# EAGLE design mainboard (EAGLE 7.6.0)
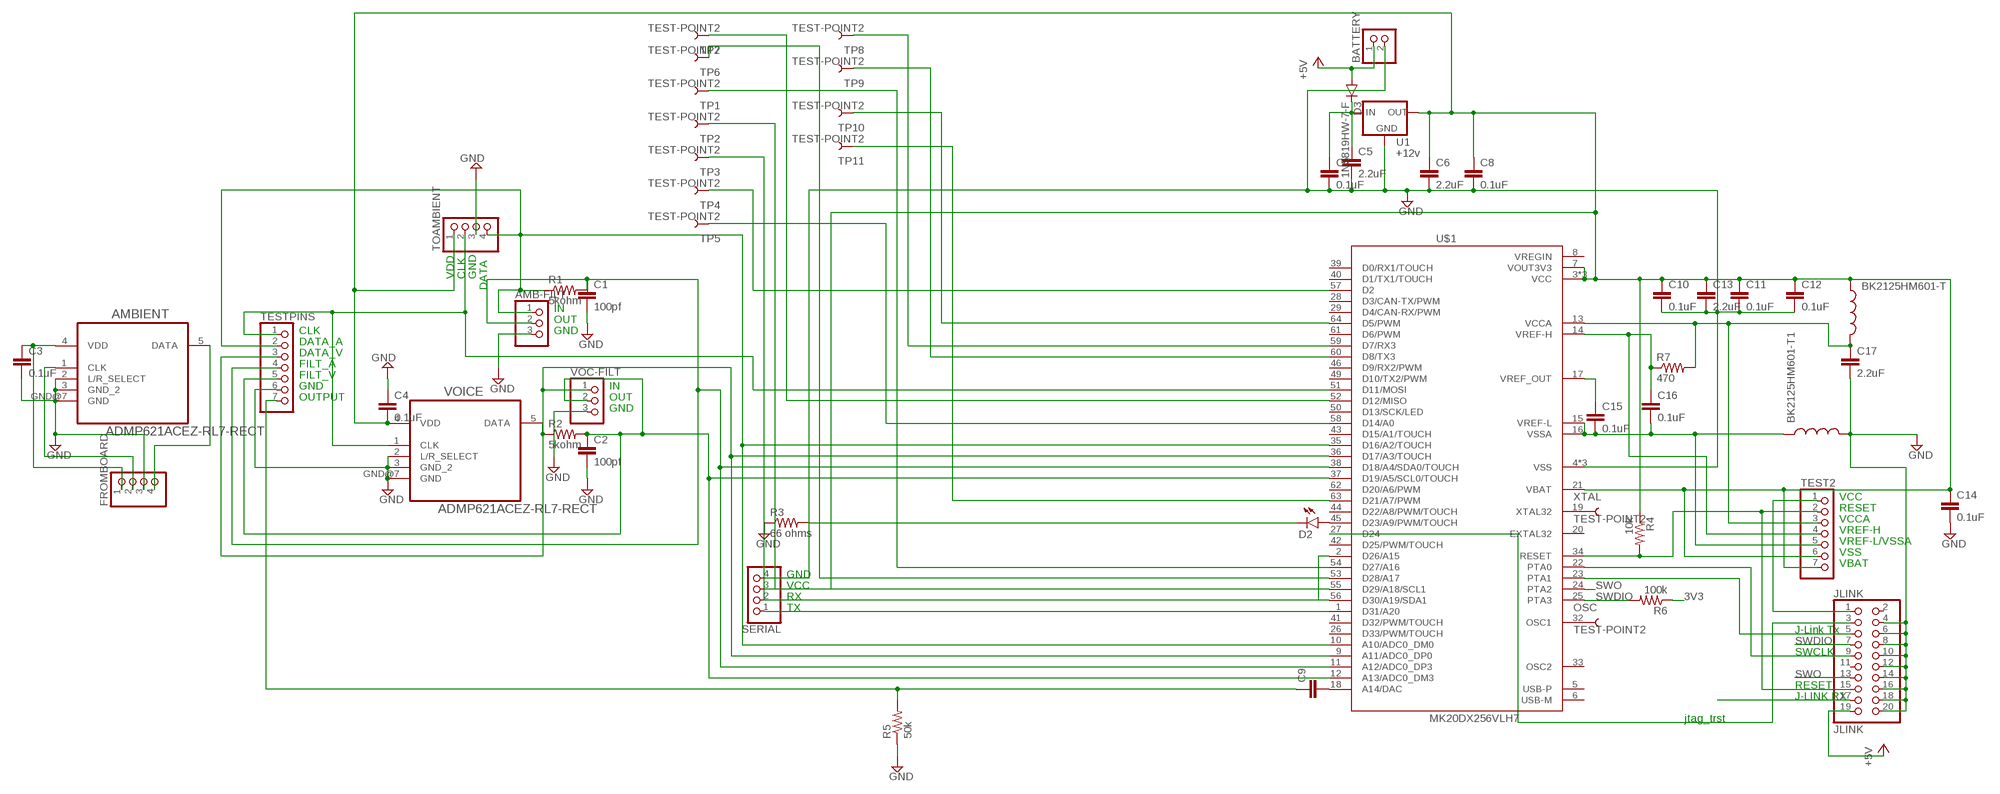
[diagram p0: schematic, sheet 1]

## Parts
AMB-FILT  PINHD-1X3  [1X03]
AMBIENT  ADMP621ACEZ-RL7-RECT  [ADMP621ACEZ-RL7-RECT]
BATTERY  PINHD-1X2  [1X02]
BK2125HM601-T  INDUCTOR0805  [0805]
BK2125HM601-T1  INDUCTOR0805  [0805]
C1  100pf  CAP0805  [0805]
C2  100pf  CAP0805  [0805]
C3  0.1uF  CAP0805  [0805]
C4  0.1uF  CAP0805  [0805]
C5  2.2uF  CAP0805  [0805]
C6  2.2uF  CAP0805  [0805]
C7  0.1uF  CAP0805  [0805]
C8  0.1uF  CAP0805  [0805]
C9  CAP0805  [0805]
C10  0.1uF  CAP0805  [0805]
C11  0.1uF  CAP0805  [0805]
C12  0.1uF  CAP0805  [0805]
C13  2.2uF  CAP0805  [0805]
C14  0.1uF  CAP0805  [0805]
C15  0.1uF  CAP0805  [0805]
C16  0.1uF  CAP0805  [0805]
C17  2.2uF  CAP0805  [0805]
D2  LED1206  [LED-1206]
D3  1N5819HW-7-F  DIODESOD123  [SOD-123]
FROMBOARD  PINHD-1X4  [1X04]
JLINK  JLINK  PINHD-2X10  [2X10]
OSC  TEST-POINT2  [PAD.02X.02]
R1  5kohm  RESISTOR0805-RES  [0805]
R2  5kohm  RESISTOR0805-RES  [0805]
R3  66 ohms  RESISTOR0805-RES  [0805]
R4  10k  RESISTOR0805-RES  [0805]
R5  50k  RESISTOR0805-RES  [0805]
R6  100k  RESISTOR0805-RES  [0805]
R7  470  RESISTOR0805-RES  [0805]
SERIAL  PINHD-1X4  [1X04]
TEST2  PINHD-1X7  [1X07]
TESTPINS  PINHD-1X7  [1X07]
TOAMBIENT  PINHD-1X4M  [1X04M]
TP1  TEST-POINT2  [PAD.02X.02]
TP2  TEST-POINT2  [PAD.02X.02]
TP3  TEST-POINT2  [PAD.02X.02]
TP4  TEST-POINT2  [PAD.02X.02]
TP5  TEST-POINT2  [PAD.02X.02]
TP6  TEST-POINT2  [PAD.02X.02]
TP7  TEST-POINT2  [PAD.02X.02]
TP8  TEST-POINT2  [PAD.02X.02]
TP9  TEST-POINT2  [PAD.02X.02]
TP10  TEST-POINT2  [PAD.02X.02]
TP11  TEST-POINT2  [PAD.02X.02]
U1  +12v  V_REG_78XX7812  [TO-252]
U$1  MK20DX256VLH7  [QFP50P1200X1200X160-64N]
VOC-FILT  PINHD-1X3  [1X03]
VOICE  ADMP621ACEZ-RL7-RECT  [ADMP621ACEZ-RL7-RECT]
XTAL  TEST-POINT2  [PAD.02X.02]

## Nets
3V3: R6.1
+5V: BATTERY.1 D3.A JLINK.19
CLK: TESTPINS.1 TOAMBIENT.2 U$1.51(D11/MOSI) VOICE.1(CLK)
CLK2-A: AMBIENT.1(CLK) FROMBOARD.2
DATA: R2.1 TESTPINS.3 U$1.9(A11/ADC0_DP0) U$1.36(D17/A3/TOUCH) VOC-FILT.1 VOICE.5(DATA)
DATA2: AMB-FILT.1 R1.1 TESTPINS.2 TOAMBIENT.4 U$1.10(A10/ADC0_DM0) U$1.35(D16/A2/TOUCH)
DATA2-A: AMBIENT.5(DATA) FROMBOARD.4
GND: AMB-FILT.3 AMBIENT.2(L/R_SELECT) AMBIENT.3(GND_2) AMBIENT.GND@7(GND) BATTERY.2 BK2125HM601-T1.2 C1.2 C2.2 C3.2 C4.1 C5.2 C6.2 C7.2 C8.2 C10.2 C11.2 C12.2 C13.2 C14.2 C17.2 FROMBOARD.3 JLINK.4 JLINK.6 JLINK.8 JLINK.10 JLINK.12 JLINK.14 JLINK.16 JLINK.18 JLINK.20 R3.1 R5.1 SERIAL.4 TESTPINS.6 TOAMBIENT.3 U1.3(GND) U$1.4(VSS) U$1.31(VSS) U$1.47(VSS) VOC-FILT.3 VOICE.2(L/R_SELECT) VOICE.3(GND_2) VOICE.GND@7(GND)
JTAG_TRST: JLINK.3 U$1.27(D24)
N$1: AMB-FILT.2 C1.1 R1.2 TESTPINS.4 U$1.11(A12/ADC0_DP3) U$1.38(D18/A4/SDA0/TOUCH)
N$2: C2.1 R2.2 TESTPINS.5 U$1.12(A13/ADC0_DM3) U$1.37(D19/A5/SCL0/TOUCH) VOC-FILT.2
N$3: TP7.P$1 U$1.52(D12/MISO)
N$4: TP6.P$1 U$1.53(D28/A17)
N$5: TP1.P$1 U$1.54(D27/A16)
N$6: TP2.P$1 U$1.55(D29/A18/SCL1)
N$7: TP3.P$1 U$1.56(D30/A19/SDA1)
N$8: TP4.P$1 U$1.57(D2)
N$9: TP5.P$1 U$1.58(D14/A0)
N$10: TP8.P$1 U$1.59(D7/RX3)
N$12: TP9.P$1 U$1.60(D8/TX3)
N$13: JLINK.5 U$1.23(PTA1)
N$14: JLINK.9 U$1.22(PTA0)
N$15: C5.1 C7.1 D3.C U1.2(IN)
N$16: JLINK.1 TEST2.1
N$17: D2.A U$1.45(D23/A9/PWM/TOUCH)
N$18: TP10.P$1 U$1.64(D5/PWM)
N$19: D2.C R3.2
N$20: BK2125HM601-T1.1 C15.2 C16.2 TEST2.5 U$1.15(VREF-L) U$1.16(VSSA)
N$21: TP11.P$1 U$1.63(D21/A7/PWM)
N$22: C16.1 R7.1 TEST2.4 U$1.14(VREF-H)
N$23: U$1.19(XTAL32) XTAL.P$1
N$24: JLINK.17
N$25: SERIAL.1 U$1.1(D31/A20)
N$26: SERIAL.2 U$1.2(D26/A15)
N$27: C9.2 U$1.18(A14/DAC)
N$28: C9.1 R5.2 TESTPINS.7
N$29: OSC.P$1 U$1.32(OSC1)
N$30: BK2125HM601-T.2 C17.1 R7.2 TEST2.3 U$1.13(VCCA)
N$31: C15.1 U$1.17(VREF_OUT)
RESET: JLINK.15 R4.2 TEST2.2 U$1.34(RESET)
SWDIO: JLINK.7 R6.2 U$1.25(PTA3)
SWO: JLINK.13 U$1.24(PTA2)
VDD-DECOUP: BK2125HM601-T.1 C4.2 C6.1 C8.1 C10.1 C11.1 C12.1 C13.1 C14.1 R4.1 SERIAL.3 TEST2.6 TEST2.7 TOAMBIENT.1 U1.1(OUT) U$1.3(VCC) U$1.7(VOUT3V3) U$1.21(VBAT) U$1.30(VCC) U$1.48(VCC) VOICE.4(VDD)
VDD-DECOUP-A: AMBIENT.4(VDD) C3.1 FROMBOARD.1
Unconnected: JLINK.2 JLINK.11 U$1.5(USB-P) U$1.6(USB-M) U$1.8(VREGIN) U$1.20(EXTAL32) U$1.26(D33/PWM/TOUCH) U$1.28(D3/CAN-TX/PWM) U$1.29(D4/CAN-RX/PWM) U$1.33(OSC2) U$1.39(D0/RX1/TOUCH) U$1.40(D1/TX1/TOUCH) U$1.41(D32/PWM/TOUCH) U$1.42(D25/PWM/TOUCH) U$1.43(D15/A1/TOUCH) U$1.44(D22/A8/PWM/TOUCH) U$1.46(D9/RX2/PWM) U$1.49(D10/TX2/PWM) U$1.50(D13/SCK/LED) U$1.61(D6/PWM) U$1.62(D20/A6/PWM)

## Notes on the sheet
- VDD | CLK | GND
- DATA
- IN
- OUT
- CLK | GND
- DATA_A
- DATA_V
- FILT_A
- FILT_V
- GND | IN
- OUTPUT | OUT
- GND
- VCC
- RESET
- VCCA
- VREF-H
- VREF-L/VSSA
- VSS
- VBAT
- GND
- VCC
- RX
- TX
- J-Link Tx
- SWCLK
- RESET
- J-LINK RX
- jtag_trst

## Library data of the parts
AMB-FILT VOC-FILT = pinhead:PINHD-1X3: PIN HEADER
AMBIENT VOICE = InvenSense-INMP621ACEZ-R7-rect:ADMP621ACEZ-RL7-RECT: IC, MICROPHONE, 2 CH , LGA_CAV-5; MPN: ADMP621ACEZ-RL7; OC_FARNELL: 2361525; OC_NEWARK: 08X1061; PACKAGE: 5LGA; SUPPLIER: ANALOG DEVICES
BATTERY = pinhead:PINHD-1X2: PIN HEADER
BK2125HM601-T BK2125HM601-T1 = SparkFun-Passives:INDUCTOR: Inductors Basic Inductor/Choke - 0603 and 1206. Footprints are not proven and vary greatly between part numbers. INDUCTOR POWER 3.3UH 4.0A SMD 0.197" L x 0.197" W x 0.177" H (5.00mm x 5.00mm x 4.50mm)
C1-C17 = SparkFun-Capacitors:CAP: Capacitor Standard 0603 ceramic capacitor, and 0.1" leaded capacitor.
D2 = SparkFun-LED:LED: LEDs Standard schematic elements and footprints for 5mm, 3mm, 1206, and 0603 sized LEDs. 5mm - Spark Fun Electronics SKU : COM-00529 (and others)
D3 = SparkFun-DiscreteSemi:DIODE: Diode These are standard reverse protection diodes and small signal diodes. SMA package can handle up to about 1A. SOD-323 can handle about 200mA. What the SOD-323 package when ordering, there are some mfgs out there that are 5-pin packages.
FROMBOARD SERIAL TOAMBIENT = pinhead:PINHD-1X4: PIN HEADER
JLINK = pinhead:PINHD-2X10: PIN HEADER
OSC TP1-TP11 XTAL = SparkFun-Passives:TEST-POINT: Bare copper test points for troubleshooting or ICT
R1-R7 = SparkFun-Passives:RESISTOR: Resistor Basic schematic elements and footprints for 0603, 1206, and PTH resistors.
TEST2 TESTPINS = pinhead:PINHD-1X7: PIN HEADER
U1 = LP38691:V_REG_78XX: Voltage Regulator Standard 78xx regulator. IGO (Input Ground Output). Spark Fun Electronics SKU : COM-00107; PROD_ID: VREG-12370
U$1 = Teensy_DIY_v1.0:MK20DX256VLH7: This is a footprint for the MK20dx256VHL7, the chip at the heart of the Teensy 3.1. Notable upgrades over the Teensy 3.0 include more Flash Memory, RAM, a DAC output, additional ADC pins, etc. Remember, if you want to use USB, VOut3v3 has to be attached to the 3.3V bus.

## Board
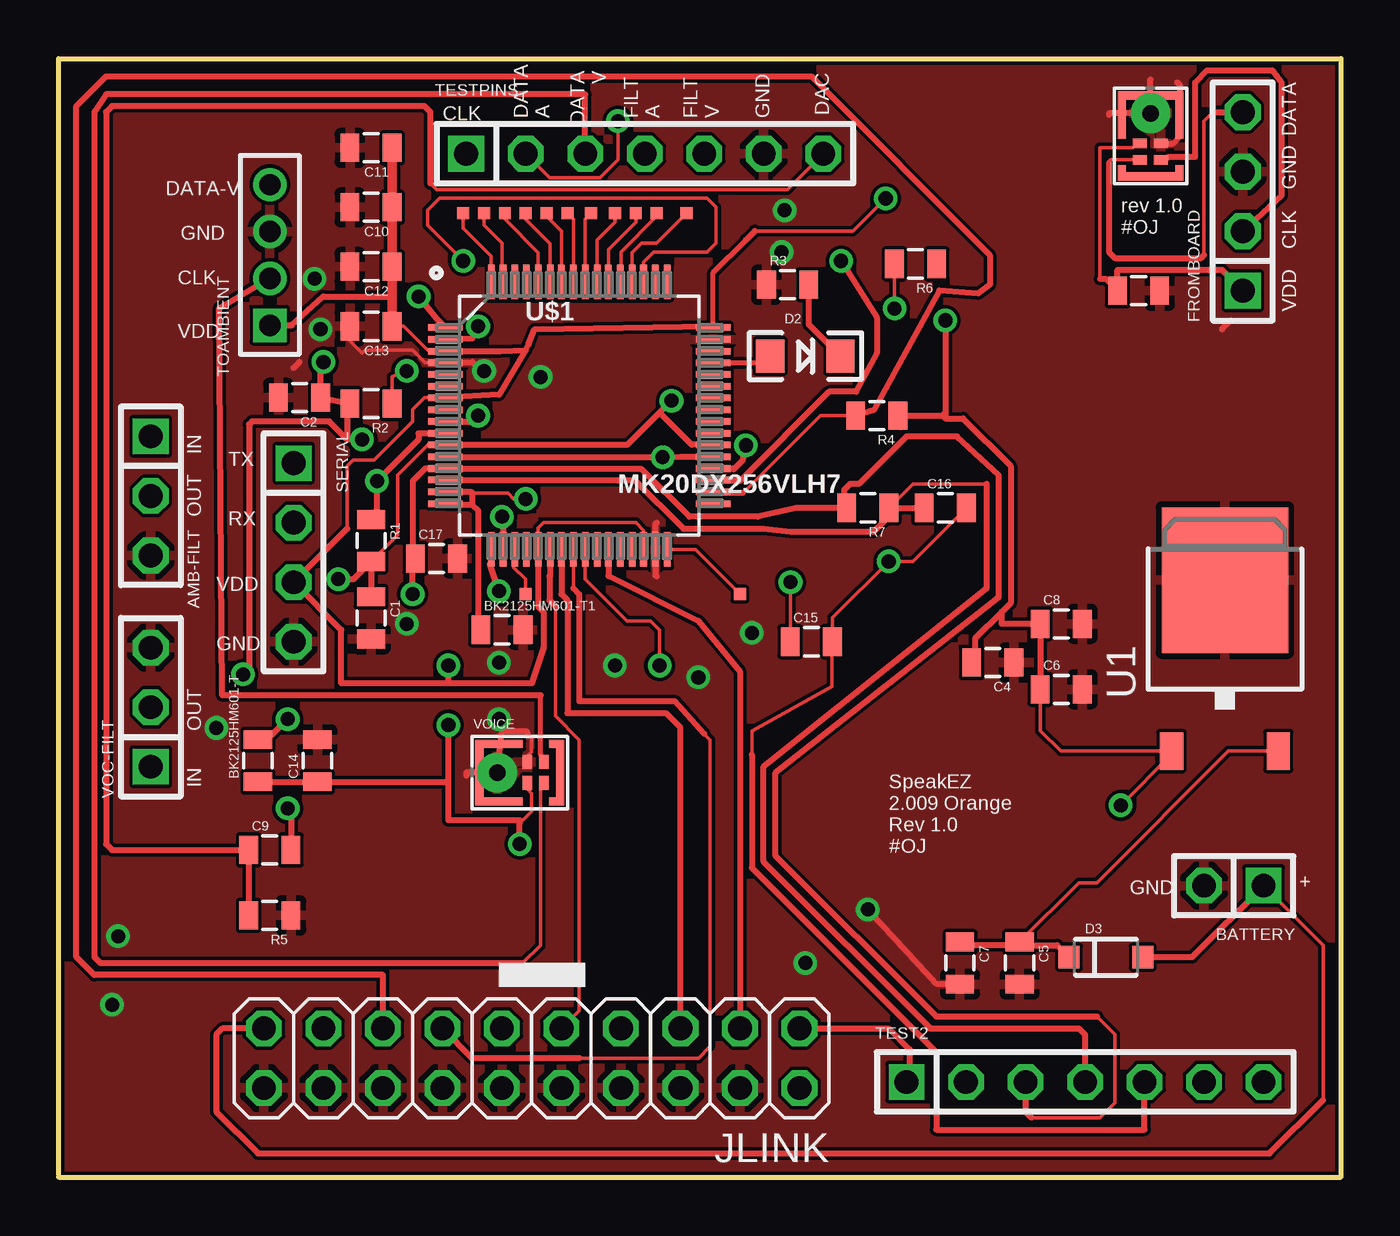
[diagram p1: board, top side]
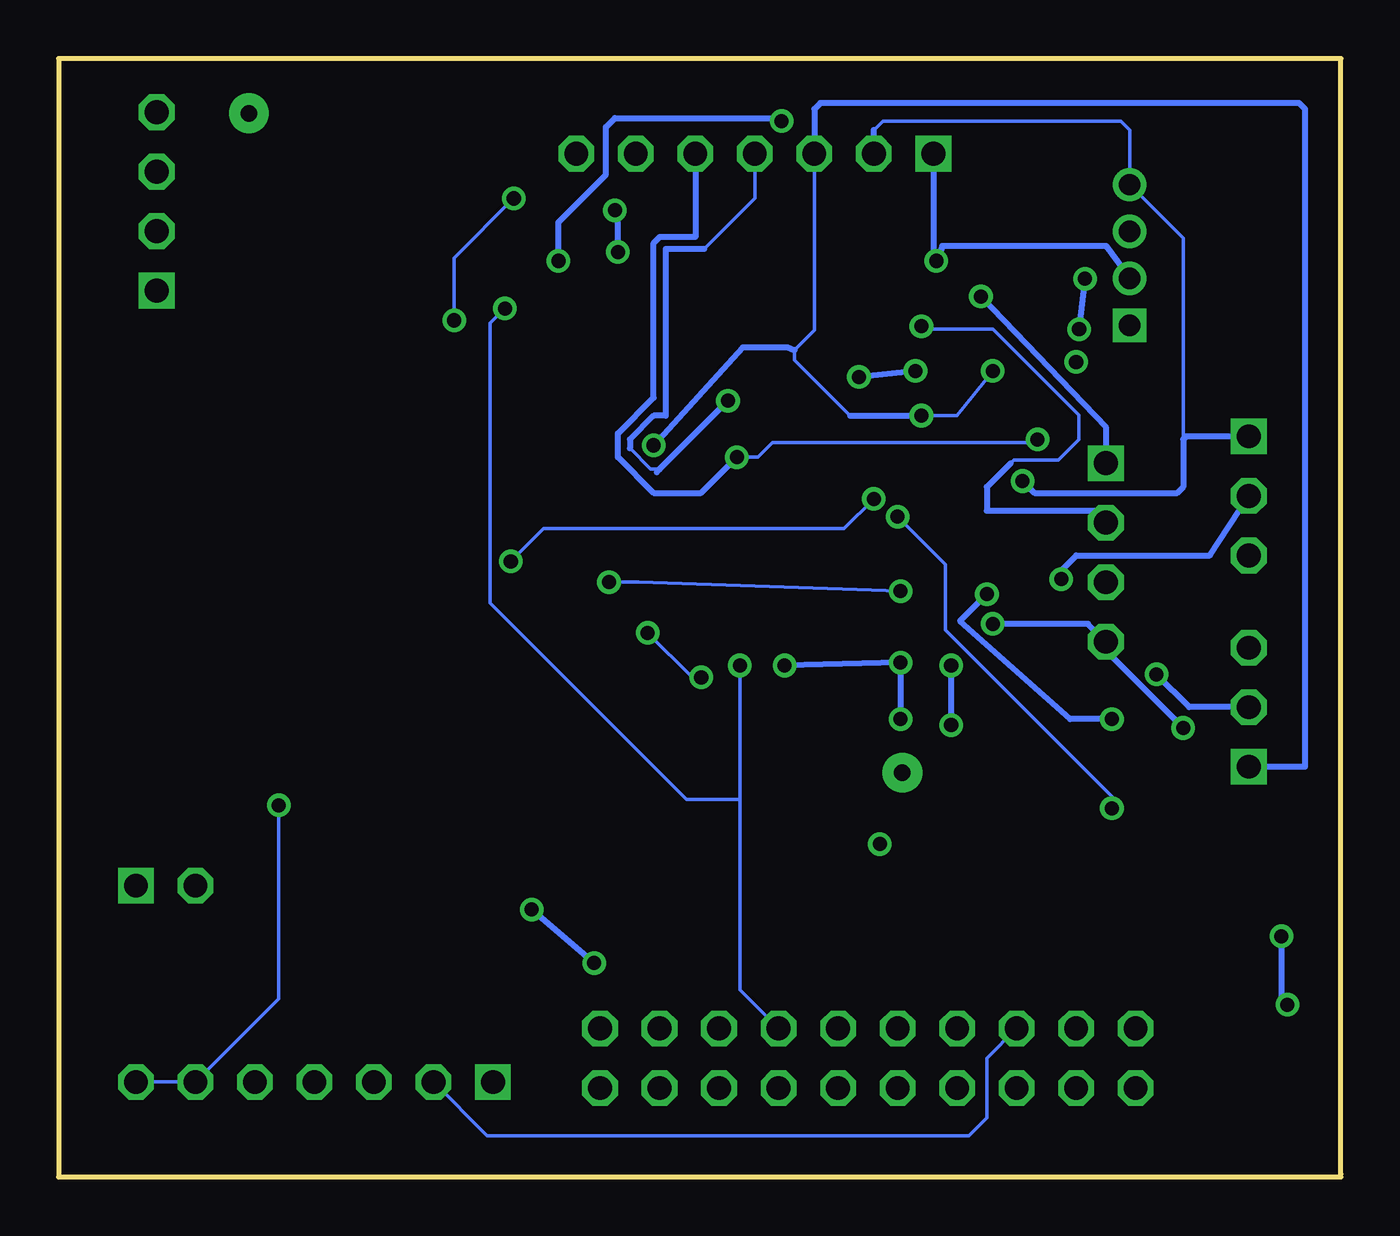
[diagram p2: board, bottom side, seen from below]

Size 54.74 x 47.75 mm. Coordinates in mm from the lower left corner, seen from the top.
Outline: 0,0.13 0,47.75 54.74,47.75 54.74,0 0,0
Copper layers (1*16): Top 0.035mm / dielectric 1.5mm / Bottom 0.035mm
Design rules "default *": minimum track width 6mil, minimum drill 10mil, track to track 6mil, track to pad 6mil, pad to pad 6mil, via to via 6mil, smd to smd 6mil, copper to edge 6mil, drill to drill 6mil, minimum pad ring 10mil, minimum via ring 8mil, stop-mask expansion 4mil, vias tented up to drill 0mil, thermal gap 10mil

### Footprints (pad centres in the part's own frame; a part is rotated, then mirrored left to right if it is on the bottom)
1X03 = drill 1.016 square: 1 -2.54,0 | drill 1.016 octagon: 2 0,0; 3 2.54,0
ADMP621ACEZ-RL7-RECT = smd 0.4 x 0.6: 1 1.025,0.45; 2 0.325,0.45; 4 0.325,-0.45; 5 1.025,-0.45 | smd 0.051 x 0.051: 3 -1.727,0 | smd 0.35 x 2.1: GND@1 1.725,0; GND@6 -1.725,0 | smd 0.65 x 0.35: GND@2 1.575,1.225; GND@3 1.575,-1.225 | smd 2.025 x 0.35: GND@4 -0.887,-1.225; GND@5 -0.887,1.225 | drill 0.7 pad 1.7: GND@7 -0.965,0
1X02 = drill 1.016 square: 1 -1.27,0 | drill 1.016 octagon: 2 1.27,0
0805 = smd 0.8 x 1.2: 1 -0.9,0; 2 0.9,0
LED-1206 = smd 1.2 x 1.4: A -1.5,0; C 1.5,0
SOD-123 = smd 0.9 x 0.95: A 1.575,0; C -1.575,0
1X04 = drill 1.016 square: 1 -3.81,0 | drill 1.016 octagon: 2 -1.27,0; 3 1.27,0; 4 3.81,0
2X10 = drill 1.016 octagon: 1 -11.43,-1.27; 2 -11.43,1.27; 3 -8.89,-1.27; 4 -8.89,1.27; 5 -6.35,-1.27; 6 -6.35,1.27; 7 -3.81,-1.27; 8 -3.81,1.27; 9 -1.27,-1.27; 10 -1.27,1.27; 11 1.27,-1.27; 12 1.27,1.27; 13 3.81,-1.27; 14 3.81,1.27; 15 6.35,-1.27; 16 6.35,1.27; 17 8.89,-1.27; 18 8.89,1.27; 19 11.43,-1.27; 20 11.43,1.27
PAD.02X.02 = smd 0.508 x 0.508: P$1 0,0
1X07 = drill 1.016 square: 1 -7.62,0 | drill 1.016 octagon: 2 -5.08,0; 3 -2.54,0; 4 0,0; 5 2.54,0; 6 5.08,0; 7 7.62,0
1X04M = drill 0.914 square: 1 -3,0 | drill 0.914: 2 -1,0; 3 1,0; 4 3,0
TO-252 = smd 1 x 1.6: 1 -2.28,-4.8; 2 2.28,-4.8 | smd 5.4 x 6.2: 3 0,2.5
QFP50P1200X1200X160-64N = smd 1.473 x 0.279: 1 -5.715,3.759; 2 -5.715,3.251; 3 -5.715,2.743; 4 -5.715,2.261; 5 -5.715,1.753; 6 -5.715,1.245; 7 -5.715,0.762; 8 -5.715,0.254; 9 -5.715,-0.254; 10 -5.715,-0.762; 11 -5.715,-1.245; 12 -5.715,-1.753; 13 -5.715,-2.261; 14 -5.715,-2.743; 15 -5.715,-3.251; 16 -5.715,-3.759; 33 5.715,-3.759; 34 5.715,-3.251; 35 5.715,-2.743; 36 5.715,-2.261; 37 5.715,-1.753; 38 5.715,-1.245; 39 5.715,-0.762; 40 5.715,-0.254; 41 5.715,0.254; 42 5.715,0.762; 43 5.715,1.245; 44 5.715,1.753; 45 5.715,2.261; 46 5.715,2.743; 47 5.715,3.251; 48 5.715,3.759 | smd 0.279 x 1.473: 17 -3.759,-5.715; 18 -3.251,-5.715; 19 -2.743,-5.715; 20 -2.261,-5.715; 21 -1.753,-5.715; 22 -1.245,-5.715; 23 -0.762,-5.715; 24 -0.254,-5.715; 25 0.254,-5.715; 26 0.762,-5.715; 27 1.245,-5.715; 28 1.753,-5.715; 29 2.261,-5.715; 30 2.743,-5.715; 31 3.251,-5.715; 32 3.759,-5.715; 49 3.759,5.715; 50 3.251,5.715; 51 2.743,5.715; 52 2.261,5.715; 53 1.753,5.715; 54 1.245,5.715; 55 0.762,5.715; 56 0.254,5.715; 57 -0.254,5.715; 58 -0.762,5.715; 59 -1.245,5.715; 60 -1.753,5.715; 61 -2.261,5.715; 62 -2.743,5.715; 63 -3.251,5.715; 64 -3.759,5.715

### Placement (x,y rotation side)
AMB-FILT  3.94,29.08 270 top
AMBIENT  46.61,44.45 270 top
BATTERY  50.16,12.45 180 top
BK2125HM601-T  8.51,17.78 90 top
BK2125HM601-T1  18.92,23.37 0 top
C1  13.34,23.88 270 top
C2  10.29,33.27 180 top
C3  46.1,37.85 0 top
C4  39.88,21.97 180 top
C5  41.02,9.14 270 top
C6  42.8,20.83 0 top
C7  38.48,9.14 270 top
C8  42.8,23.62 0 top
C9  9.02,13.97 0 top
C10  13.34,41.4 180 top
C11  13.34,43.94 180 top
C12  13.34,38.86 180 top
C13  13.34,36.32 180 top
C14  11.05,17.78 90 top
C15  32.13,22.86 0 top
C16  37.85,28.57 0 top
C17  16.13,26.42 0 top
D2  31.88,35.05 0 top
D3  44.7,9.4 0 top
FROMBOARD  50.55,41.66 90 top
JLINK  20.19,5.08 180 top
OSC  29.08,24.89 0 top
R1  13.34,27.18 270 top
R2  13.34,33.02 180 top
R3  31.11,38.1 0 top
R4  34.92,32.51 180 top
R5  9.02,11.18 180 top
R6  36.58,38.99 180 top
R7  34.54,28.57 180 top
SERIAL  10.03,26.67 270 top
TEST2  43.81,4.06 0 top
TESTPINS  25.02,43.69 0 top
TOAMBIENT  9.02,39.37 90 top
TP1  24.64,41.15 0 top
TP2  23.75,41.15 90 top
TP3  22.73,41.15 90 top
TP4  21.72,41.15 90 top
TP5  20.83,41.15 90 top
TP6  25.53,41.15 90 top
TP7  26.8,41.15 90 top
TP8  19.94,41.15 90 top
TP9  19.05,41.15 90 top
TP10  17.27,41.15 90 top
TP11  18.16,41.15 90 top
U1  49.78,22.99 0 top
U$1  22.23,32.51 0 top
VOC-FILT  3.94,20.07 90 top
VOICE  19.68,17.27 0 top
XTAL  19.94,24.89 0 top

### Tracks (layer width: path | path; a pad name or v marks a point on that pad's centre or on a via)
+5V
  Top 0.152: 53.98,3.3 53.98,9.91 BATTERY.1
  Top 0.254: JLINK.19 6.99,6.35 6.73,6.1 6.73,2.79 8.51,1.02 51.69,1.02 53.98,3.3 | D3.A 48.39,9.4 BATTERY.1
CLK  (via drill 0.6)
  Top 0.152: v17.27,39.12 15.75,40.64 15.75,41.28 16.26,41.78 27.69,41.78 28.07,41.4 28.07,39.88 27.69,39.5 25.4,39.5 24.97,39.07 U$1.51
  Top 0.203: VOICE.1 20.71,17.9 20.57,18.03 20.57,20.57
  Top 0.254: 20.57,20.57 6.99,20.57 6.86,37.1 TOAMBIENT.2
  Bottom 0.254: TOAMBIENT.2 10.02,39.75 17.02,39.75 v17.27,39.12 17.4,39.24 TESTPINS.1
CLK2-A
  Top 0.254: AMBIENT.1 47.23,43.43 47.37,43.56 48.51,43.56 48.51,46.74 49.02,47.24 51.82,47.24 52.2,46.74 52.2,41.91 FROMBOARD.2
DATA  (via drill 0.6)
  Top 0.152: 19.81,9.14 20.57,9.91 20.57,16.69 VOICE.5 | v14.86,34.42 14.23,34.17 R2.1
  Top 0.254: R2.1 14.23,33.41 | U$1.9 17.65,32.26 v17.91,32.51 | U$1.36 28.8,30.25 28.83,30.23 29.21,30.61 v29.34,31.24 | TESTPINS.3 22.48,46.23 2.03,46.23 1.52,45.47 1.52,9.4 1.78,9.14 19.81,9.14 | VOICE.5 20.71,16.65
  Bottom 0.152: TESTPINS.3 22.48,36.15 23.32,35.31 23.32,34.88 20.95,32.51 | v17.91,32.51 16.38,32.51 v14.86,34.42
  Bottom 0.254: 20.95,32.51 v17.91,32.51 | VOC-FILT.1 1.52,17.53 1.52,45.59 1.78,45.85 22.23,45.85 22.48,45.59 TESTPINS.3 | v29.34,31.24 25.53,35.43 23.62,35.43 23.32,35.31
DATA2  (via drill 0.6)
  Top 0.152: v23.88,45.09 23.88,43.43 23.11,42.67 20.95,42.67 TESTPINS.2
  Top 0.254: U$1.10 15.37,31.75 15.37,31.5 v13.59,29.72 13.59,28.33 R1.1 | TOAMBIENT.4 9.02,42.42 | v33.4,39.12 34.92,36.7 34.92,35.18 34.04,33.53 32.89,33.53 29.08,29.72 27.99,29.72 U$1.35
  Bottom 0.152: 6.73,31.5 6.73,40.08 TOAMBIENT.4 9.02,44.7 9.4,45.09 19.56,45.09 19.94,44.7
  Bottom 0.254: v13.59,29.72 13.08,29.21 6.99,29.21 6.73,29.46 6.73,31.5 6.6,31.62 AMB-FILT.1 | TESTPINS.2 19.94,44.7 | v33.4,39.12 33.4,40.77 31.37,42.8 31.37,44.83 30.99,45.21 24,45.21 v23.88,45.09
DATA2-A
  Top 0.152: 46.1,43.43 44.96,43.43 arc90 44.83,43.31 | 49.28,45.47 48.9,45.09 48.9,39.37
  Top 0.254: 44.83,43.31 44.83,39.5 45.09,39.24 48.77,39.24 48.9,39.37 | 49.28,45.47 FROMBOARD.4 | AMBIENT.5 46.23,43.43 | 46.1,43.43 AMBIENT.5 | AMBIENT.5
GND  (via drill 0.6)
  Top 0.152: VOICE.2 20.01,17.98 20.19,18.16 20.19,18.8 20.01,18.98 | U$1.4 15.65,34.77 15.11,35.31 13.08,35.31 12.95,35.18 12.44,35.7 C13.2
  Top 0.254: 25.53,27.94 25.48,27.89 U$1.31 25.48,25.7 25.53,25.65 | 20.01,18.98 19.94,19.05 18.92,19.05 | 10.29,34.8 10.03,34.54 | v18.8,19.56 18.92,19.05 | 49.66,36.2 50.04,36.58 | AMBIENT.2 47.55,44.12 47.88,44.45 47.88,46.61 47.75,46.74 | 18.92,19.05 VOICE.GND@7 VOICE.3 17.4,17.27 17.4,17.14 | 46.61,46.86 AMBIENT.3 AMBIENT.GND@7 44.83,45.41 44.83,45.34 | U$1.4 17.65,34.8 v18.16,34.42 | v34.54,11.43 37.47,8.26 38.61,8.26
  Bottom 0.152: v27.3,21.34 27.69,21.34 v29.59,23.24
  Bottom 0.254: v14.86,23.62 10.79,23.62 SERIAL.4 10.03,22.48 v6.73,19.18 | v18.8,19.56 v18.8,21.97 v23.75,21.84 | v30.86,39.5 30.86,41.15 v30.99,41.28 | v10.92,38.35 v11.18,36.2 | v2.54,10.29 2.54,7.62 v2.29,7.37 | v18.16,34.42 v20.57,34.16 | v31.88,9.14 v34.54,11.43
  pour Top: -1.02,49.28 -1.27,-1.14 59.18,-1.02 59.44,49.4
JTAG_TRST
  Top 0.254: U$1.27 23.47,25.68 23.5,25.65 27.3,23.75 29.08,21.59 JLINK.3
N$1  (via drill 0.6)
  Top 0.152: U$1.11 15.77,31.27 14.48,29.97 14.48,27.42 R1.2
  Top 0.254: C1.1 R1.2 12.58,25.53 v11.94,25.53 | U$1.11 24.28,31.27 25.65,32.64 | 25.65,32.64 v26.16,33.15 | U$1.38 27.03,31.27 25.65,32.64
  Bottom 0.152: 30.35,31.11 29.46,30.23 29.08,30.23 | TESTPINS.4 25.02,41.78 27.18,39.62
  Bottom 0.254: 27.18,39.62 28.83,39.62 28.83,32.51 29.34,32.51 30.35,31.5 30.35,31.11 | v11.94,25.53 11.94,25.91 11.3,26.54 5.59,26.54 AMB-FILT.2 | 29.21,30.1 29.08,30.23 v26.16,33.15
N$2  (via drill 0.6)
  Top 0.254: U$1.12 17.04,30.73 v25.78,30.73 26.57,30.76 U$1.37 | v11.3,34.8 11.19,34.68 C2.1 R2.2 12.32,33.16 12.32,31.5 | v12.95,31.5 12.32,31.5 | 12.32,31.5 11.56,32.26 8.26,32.26 8.13,32.13 8.13,21.72 v7.87,21.46
  Bottom 0.152: v12.95,31.5 13.34,31.37 24.26,31.37 24.89,30.73 v25.78,30.73
  Bottom 0.254: TESTPINS.5 27.56,40.13 29.08,40.13 29.34,39.88 29.34,33.27 30.86,31.75 30.86,30.73 29.34,29.21 27.3,29.21 v25.78,30.73 | VOC-FILT.2 6.48,20.07 v7.87,21.46
N$3
  Top 0.152: TP7.P$1 25.53,39.88 24.89,39.88 24.49,39.47 U$1.52
N$4
  Top 0.152: TP6.P$1 25.53,41.02 24,39.5 24,38.25 U$1.53
N$5
  Top 0.152: TP1.P$1 24.64,40.77 23.47,39.6 U$1.54
N$6
  Top 0.152: TP2.P$1 23.75,40.77 22.99,40.01 U$1.55
N$7
  Top 0.152: TP3.P$1 22.48,40.89 U$1.56
N$8
  Top 0.152: TP4.P$1 21.97,40.89 U$1.57
N$9
  Top 0.152: TP5.P$1 20.83,41.02 21.46,40.39 U$1.58
N$10
  Top 0.152: TP8.P$1 19.94,40.89 20.98,39.85 U$1.59
N$12
  Top 0.152: TP9.P$1 19.05,40.89 20.47,39.47 U$1.60
N$13
  Top 0.254: U$1.23 21.46,24.89 21.72,24.64 21.72,19.81 25.93,19.81 26.54,19.19 JLINK.5
N$14
  Top 0.152: 21.21,24.38 21.21,19.68 22.23,18.67 22.23,7.11 JLINK.9
  Top 0.254: U$1.22 20.98,25.68 20.95,25.65 20.95,24.64 21.21,24.38
N$15
  Top 0.152: U1.2 49.94,18.19 44.32,12.57 43.55,12.57 C5.1
  Top 0.254: C5.1 40.91,10.04 40.77,9.91 | 40.77,9.91 38.62,9.91 C7.1 | 40.77,9.91 42.62,9.91 D3.C
N$16
  Top 0.254: JLINK.1 35.43,6.35 36.32,5.46 36.32,4.19 TEST2.1
N$17
  Top 0.203: U$1.45 30.1,34.77
  Top 0.254: 30.1,34.77 D2.A
N$18
  Top 0.152: TP10.P$1 17.27,40.51 18.47,39.32 U$1.64
N$19
  Top 0.254: R3.2 32.02,36.41 D2.C
N$20  (via drill 0.6)
  Top 0.152: 29.59,18.03 29.59,19.05 33.02,20.95 33.02,21.96 C15.2 33.03,23.89 v35.43,26.29 36.46,26.29 C16.2 | v19.94,28.96 19.43,28.96 19.18,29.21 17.65,29.21
  Top 0.254: U$1.15 17.6,29.26 17.65,29.21 17.65,28.7 | 17.65,28.7 16.56,28.7 U$1.16 | 17.65,28.7 17.91,28.45 17.91,23.48 BK2125HM601-T1.1 | TEST2.5 46.35,2.03 37.47,2.03 37.47,5.33 29.59,13.21 29.59,18.03
  Bottom 0.152: v35.43,26.29 34.04,27.69 21.21,27.69 v19.94,28.96
N$21
  Top 0.152: TP11.P$1 18.16,40.64 18.92,39.88 18.92,38.28 U$1.63
N$22
  Top 0.152: 39.62,29.59 36.46,29.59 R7.1
  Top 0.254: C16.1 R7.1 35.31,28.44 35.31,28.07 34.8,27.56 31.24,27.56 30.1,27.69 26.67,27.69 24.59,29.77 U$1.14 | 39.62,29.59 39.62,25.15 30.1,17.53 30.1,13.46 37.21,6.35 43.56,6.35 43.81,6.1 TEST2.4
N$23
  Top 0.152: U$1.19 19.43,26.8 19.43,26.04 19.94,25.53 XTAL.P$1
N$25  (via drill 0.6)
  Top 0.254: v15.37,37.59 16.13,36.65 U$1.1
  Bottom 0.254: SERIAL.1 10.02,31.99 v15.37,37.59
N$26  (via drill 0.6)
  Top 0.254: U$1.2 17.65,35.81 v17.91,36.32
  Bottom 0.152: v17.91,36.32 17.78,36.2 14.86,36.2 11.19,32.53 11.19,31.48 12.06,30.61 13.97,30.61 14.1,30.48
  Bottom 0.254: 14.1,30.48 15.11,29.46 15.11,28.45 10.54,28.45 SERIAL.2
N$27  (via drill 0.6)
  Top 0.254: v18.92,28.19 18.97,28.14 U$1.18 | v9.78,15.75 9.92,15.61 C9.2
  Bottom 0.152: v9.78,15.75 9.78,16.26 16.89,23.37 16.89,26.16 v18.92,28.19
N$28
  Top 0.152: TESTPINS.7 31.11,42.16 16.13,42.16 15.88,42.42
  Top 0.254: R5.2 C9.1 2.29,13.97 2.03,14.22 2.03,45.47 2.29,45.72 15.62,45.72 15.88,45.47 15.88,42.42
N$29
  Top 0.152: U$1.32 27.18,26.8 OSC.P$1
N$30  (via drill 0.6)
  Top 0.152: 44.32,6.86 45.09,6.1 45.09,3.17 44.45,2.54 41.53,2.54
  Top 0.254: BK2125HM601-T.2 8.9,18.68 v9.78,19.56 | TEST2.3 41.27,2.79 41.53,2.54 | 44.32,6.86 37.47,6.86 30.61,13.72 30.61,17.27 40.13,24.77 40.13,29.97 38.35,31.62 36.2,31.62 34.16,29.59 33.78,29.59 33.53,29.34 33.53,28.69 R7.2 31.5,28.57 29.84,28.19 26.92,28.19 24.89,30.23 17.04,30.23 U$1.13 15.65,30.25 15.11,29.72 15.11,26.53 C17.1 15.11,26.3 v15.11,24.89
  Bottom 0.254: v9.78,19.56 11.56,19.56 16.26,23.75 v15.11,24.89
N$31  (via drill 0.6)
  Top 0.152: v31.24,25.4 v31.23,25.4 C15.1
  Top 0.254: v18.8,25.02 18.41,26.16 18.47,26.21 U$1.17
  Bottom 0.152: v31.24,25.4 29.97,25.4 v18.8,25.02
RESET
  Top 0.152: R4.2 32.51,32.51 29.21,29.21
  Top 0.254: 29.21,29.21 27.99,29.21 U$1.34 | JLINK.15 13.84,8.64 1.52,8.64 0.76,9.4 0.76,45.72 2.03,46.99 32.13,46.99 39.75,39.37 39.75,38.1 39.24,37.72 37.59,37.85 34.8,32.76 R4.2
  Bottom 0.152: TEST2.2 36.45,1.78 15.88,1.78 15.11,2.54 15.11,5.08 JLINK.15
SWDIO  (via drill 0.6)
  Top 0.152: U$1.25 22.48,25.53 24.26,23.75 25.27,23.75 25.65,23.37 v25.65,21.84 | v35.69,37.08 35.69,38.11 R6.2
  Bottom 0.152: v25.65,21.84 25.65,16.13 | 25.65,16.13 25.65,8 JLINK.7 | v35.69,37.08 36.32,36.45 36.32,24.51 27.94,16.13 25.65,16.13
SWO
  Top 0.152: 21.97,25.15 U$1.24 | 22.23,5.08 27.3,5.08 27.81,5.59 27.81,18.67 27.56,18.92
  Top 0.254: 22.23,5.08 17.65,5.08 JLINK.13 | 21.97,25.15 22.23,24.89 22.23,20.32 26.29,20.32 27.56,18.92
VDD-DECOUP  (via drill 0.6)
  Top 0.152: v45.34,15.88 47.5,18.04 U1.1 42.77,18.19 41.91,19.05 C6.1 | 20.01,16.69 20.01,16.57 20.19,16.38 20.19,15.62 19.68,15.11 | U$1.30 24.97,27.61 24.64,27.94 20.7,27.94 20.47,27.71 U$1.21 | v35.31,41.78 33.91,40.39 29.72,40.39 | U$1.3 16.46,35.31 15.75,35.31 14.73,36.32 C13.1 | 12.32,27.69 12.32,30.35 12.57,30.61 13.46,30.61 15.11,32.26 15.11,32.77 15.62,33.27 U$1.7
  Top 0.203: U$1.48 27.94,38.61 29.34,40.01
  Top 0.254: 12.32,27.69 SERIAL.3 12.06,23.37 12.06,21.08 16.64,21.08 | U$1.3 18.85,35.26 19.94,35.31 | 19.94,35.31 18.8,33.4 U$1.7 | 19.94,35.31 20.07,35.56 20.32,36.2 27.89,36.32 U$1.48 | 29.34,40.01 29.72,40.39 | U$1.21 20.47,24.36 20.7,24.13 20.7,22.61 20.19,21.08 16.64,21.08 | v16.64,21.84 16.64,21.08 | v16.64,19.3 16.64,16.76 | 16.64,16.76 16.64,15.24 19.68,15.24 19.68,15.11 v19.68,14.22 | BK2125HM601-T.1 C14.1 16.52,16.88 16.64,16.76 | 35.94,32 R4.1 37.72,32.51 37.85,32.64 | 40.26,24.13 40.64,24.51 40.64,30.35 38.61,32.39 37.85,32.39 37.85,32.64 | 40.26,24.13 39.12,22.99 39.12,22.11 C4.2 | v37.85,36.58 37.85,32.64 | C6.1 C8.1 40.26,23.62 40.26,24.13 | TOAMBIENT.1 9.95,36.37 11.3,37.59 14.11,37.59 14.23,37.72 | VOICE.4 20.01,16.69
  Top 0.406: C11.1 C10.1 C12.1 14.23,37.72 C13.1
  Bottom 0.152: v45.34,15.88 45.34,7.62 TEST2.6 TEST2.7 | v37.85,36.58 37.85,39.24 v35.31,41.78
  Bottom 0.254: v16.64,19.3 v16.64,21.84
VDD-DECOUP-A
  Top 0.152: 46.03,44.12 45.85,43.94 44.45,43.94 44.45,38.35
  Top 0.254: FROMBOARD.1 49.66,38.73 45.21,38.73 45.2,38.72 C3.1 44.69,38.35 44.45,38.35 | AMBIENT.4 46.03,44.12

### Text on the board
tPlace: DATA / V | CLK | DATA / A | FILT / A | FILT / V | GND | DAC | DATA | DATA-V | GND | GND | CLK | CLK | VDD | VDD | IN | TX | OUT | RX | VDD | GND | OUT | IN | GND | +
tNames: rev 1.0 / #OJ | SpeakEZ / 2.009 Orange / Rev 1.0 / #OJ